# Altium project MPPT_PCB.PrjPcb
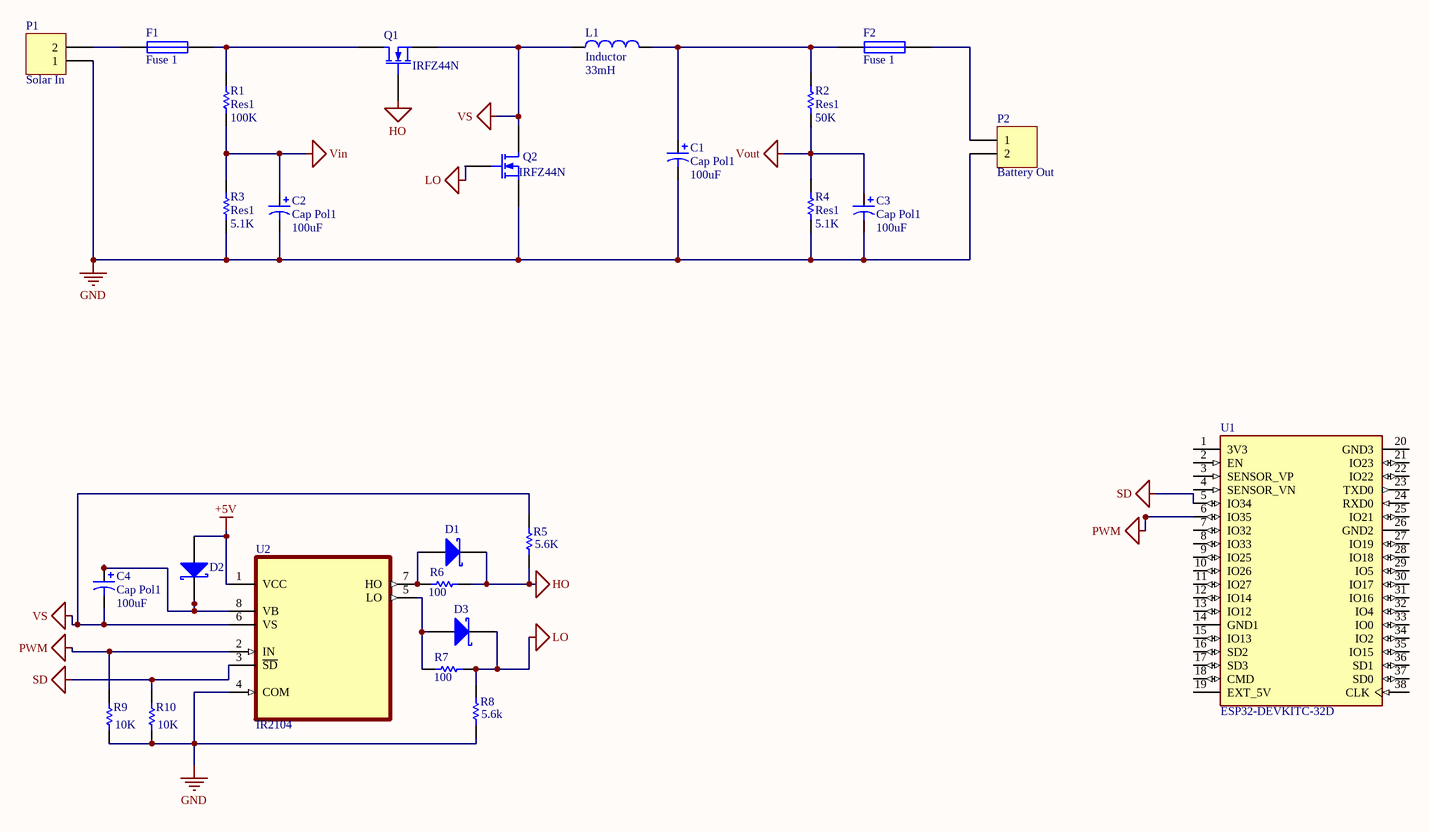
[diagram p0: schematic.SchDoc]
1 sheet, 26 parts. Net scope: global (net labels, ports and power ports of the same name join across sheets).

## Sheet schematic.SchDoc
size A3; SheetNumber: 1; SheetTotal: 1; SPICEModelCacheFEHMTGFF: <root> / <DocumentId>FEHMTGFF</DocumentId> / <CacheFrame Number="0"> / <Model Name="fuse" Kind="CKT"> / <Text>.SUBCKT FUSE 1 2 PARAMS: CURRENT=1 RESISTANCE=1m / SW1 1 2 3 0 SMOD OFF / BNLV 3 0 V=(abs(v(1,2))) / .MODEL SMOD SW (VT={(CURRENT*RESISTANCE)} RON=1g ROFF={RESISTANCE}) / .ENDS FUSE</Text> / </Model> / <Model Name="cap" Kind="MDL"> / <Text>*Default semiconductor capacitor / .MODEL CAP C()</Text> / </Model> / <Model Name="nmos" Kind="MDL"> / <Text>*Default N-Channel MOSFET / *Pinout: D,G,S / .MODEL NMOS NMOS()</Text> / </Model> / <Model Name="10tq035" Kind="MDL"> / <Text>*10TQ035 MCE 3/26/98 / *Ref: IR Power Semiconductors Product Digest '94 / *MCE 35V 10A 3us pkg:TO-220 3,1 / .MODEL 10TQ035 D (IS=14.2N RS=4.2M N=1.7 BV=35 IBV=15M / + CJO=412P VJ=0.75 M=0.333 TT=4.32U EG=.69 XTI=2)</Text> / </Model> / </CacheFrame> / </root>

### Parts
C1  Cap Pol1  value 100uF  [RB7.6-15]
C2  Cap Pol1  value 100uF  [RB7.6-15]
C3  Cap Pol1  value 100uF  [RB7.6-15]
C4  Cap Pol1  value 100uF  [RB7.6-15]
D1  Diode 10TQ035  [TO-220AC]  (value not drawn)
D2  Diode 10TQ035  [TO-220AC]  (value not drawn)
D3  Diode 10TQ035  [TO-220AC]  (value not drawn)
F1  Fuse 1  [PIN-W2/E2.8]
F2  Fuse 1  [PIN-W2/E2.8]
L1  Inductor  value 33mH  [0402-A]
P1  Solar In  [HDR1X2]
P2  Battery Out  [HDR1X2]
Q1  IRFZ44N  [E3]
Q2  IRFZ44N  [E3]
R1  Res1  value 100K  [AXIAL-0.3]
R2  Res1  value 50K  [AXIAL-0.3]
R3  Res1  value 5.1K  [AXIAL-0.3]
R4  Res1  value 5.1K  [AXIAL-0.3]
R5  value 5.6K  [AXIAL-0.3]  (hidden comment: Res1)
R6  value 100  [AXIAL-0.3]  (hidden comment: Res1)
R7  value 100  [AXIAL-0.3]  (hidden comment: Res1)
R8  value 5.6k  [AXIAL-0.3]  (hidden comment: Res1)
R9  value 10K  [AXIAL-0.3]  (hidden comment: Res1)
R10  value 10K  [AXIAL-0.3]  (hidden comment: Res1)
U1  ESP32-DEVKITC-32D  [MODULE_ESP32-DEVKITC-32D]
U2  IR2104  [DIP254P762X533-8]

### Nets
+5V: D2.3(A) U2.1(VCC)
GND: C1.2 C2.2 C3.2 P1.1 P2.2 Q2.3(S) R3.1 R4.1 R8.1 R9.1 R10.1 U2.4(COM)
HO: D1.1(K) Q1.2(G) R5.1 R6.1
LO: D3.1(K) Q2.2(G) R7.1 R8.2
PWM: R9.2 U1.6(IO35) U2.2(IN)
SD: R10.2 U1.5(IO34) U2.3(~{SD})
Vin: C2.1 R1.1 R3.2
Vout: C3.1 R2.1 R4.2
VS: C4.2 L1.1 Q1.3(S) Q2.1(D) R5.2 U2.6(VS)
NetC1_1: C1.1 F2.1 L1.2 R2.2
NetC4_1: C4.1 D2.1(K) U2.8(VB)
NetD1_3: D1.3(A) R6.2 U2.7(HO)
NetD3_3: D3.3(A) R7.2 U2.5(LO)
NetF1_1: F1.1 P1.2
NetF1_2: F1.2 Q1.1(D) R1.2
NetF2_2: F2.2 P2.1

Not connected (* = marked no-connect by the designer): U1 1(3V3) 2(EN) 3(SENSOR_VP) 4(SENSOR_VN) 7(IO32) 8(IO33) 9(IO25) 10(IO26) 11(IO27) 12(IO14) 13(IO12) 14(GND1) 15(IO13) 16(SD2) 17(SD3) 18(CMD) 19(EXT_5V) 20(GND3) 21(IO23) 22(IO22) 23(TXD0) 24(RXD0) 25(IO21) 26(GND2) 27(IO19) 28(IO18) 29(IO5) 30(IO17) 31(IO16) 32(IO4) 33(IO0) 34(IO2) 35(IO15) 36(SD1) 37(SD0) 38(CLK)

### Library data of the parts
C1-C4 = Cap Pol1: Polarized Capacitor (Radial); Published: 8-Jun-2000; LatestRevisionDate: 17-Jul-2002; LatestRevisionNote: Re-released for DXP Platform.; PackageReference: RB7.6-15; Publisher: Altium Limited; PackageDescription: Polarized Capacitor (Radial); 2 Leads
D1-D3 = Diode 10TQ035: Schottky Rectifier; Note: Terminal 2 is the TAB and is electrically connected to the cathode; Published: 8-Jun-2000; LatestRevisionDate: 17-Jul-2002; LatestRevisionNote: Re-released for DXP Platform.; DatasheetVersion: PD-2.057B; PackageVersion: Feb-1998; PackageReference: TO-220AC; Publisher: Altium Limited; PackageDescription: TO, Thru-Hole, Vertical, Heatsink Mounted; 3 In-Line Leads (1 Absent); Pitch 2.54 mm; ComponentLink1Description: Manufacturer Link; ComponentLink1URL: http://www.irf.com/; ComponentLink2Description: Datasheet; ComponentLink2URL: http://www.irf.com/product-info/datasheets/data/10tq.pdf
F1 F2 = Fuse 1: Fuse; Published: 8-Jun-2000; LatestRevisionDate: 17-Jul-2002; LatestRevisionNote: Re-released for DXP Platform.; PackageReference: PIN-W2/E2.8; Publisher: Altium Limited; PackageDescription: Thru-Hole; 2 Leads
L1 = Inductor: Code_IEC: 1005; Published: 8-Jun-2000; LatestRevisionDate: 29-May-2009; LatestRevisionNote: IPC-7351 Footprint Added.; PackageReference: 0402-A; Publisher: Altium Limited; PackageDescription: Chip Inductor; Code_JEITA: 0402
P1 P2 = Header 2: Header, 2-Pin; LatestRevisionDate: 17-Jul-2002; LatestRevisionNote: Re-released for DXP Platform.; Publisher: Altium Limited
Q1 Q2 = MOSFET-N: N-Channel MOSFET; Published: 8-Jun-2000; LatestRevisionDate: 17-Jul-2002; LatestRevisionNote: Re-released for DXP Platform.; PackageVersion: 1995/1996; PackageReference: E3; Publisher: Altium Limited; PackageDescription: TO, Flat Index; 3 In-Line, Axial Leads; Body Dia. 4.6mm; Lead Dia. 0.5 mm (max)
R1-R10 = Res1: Resistor; Published: 8-Jun-2000; LatestRevisionDate: 17-Jul-2002; LatestRevisionNote: Re-released for DXP Platform.; PackageReference: AXIAL-0.3; Publisher: Altium Limited; PackageDescription: Axial Device, Thru-Hole; 2 Leads; 0.3 in Pin Spacing
U1 = ESP32-DEVKITC-32D: Eval Board For Esp-Wroom-32; Package: None; Availability: Unavailable; Value: *; MP: ESP32-DEVKITC-32D; Price: None
U2 = IR2104: Half-Bridge Gate Driver IC Non-Inverting 8-PDIP; MF: Infineon Technologies; MP: IR2104; SnapEDA_Link: https://www.snapeda.com/parts/IR2104/Infineon%20Technologies/view-part/524562/?ref=snap; Availability: Unavailable; Package: DIP-8 Infineon; Price: None; Value: *